# EAGLE design mikrobus-relay-1 (EAGLE 9.6.2)
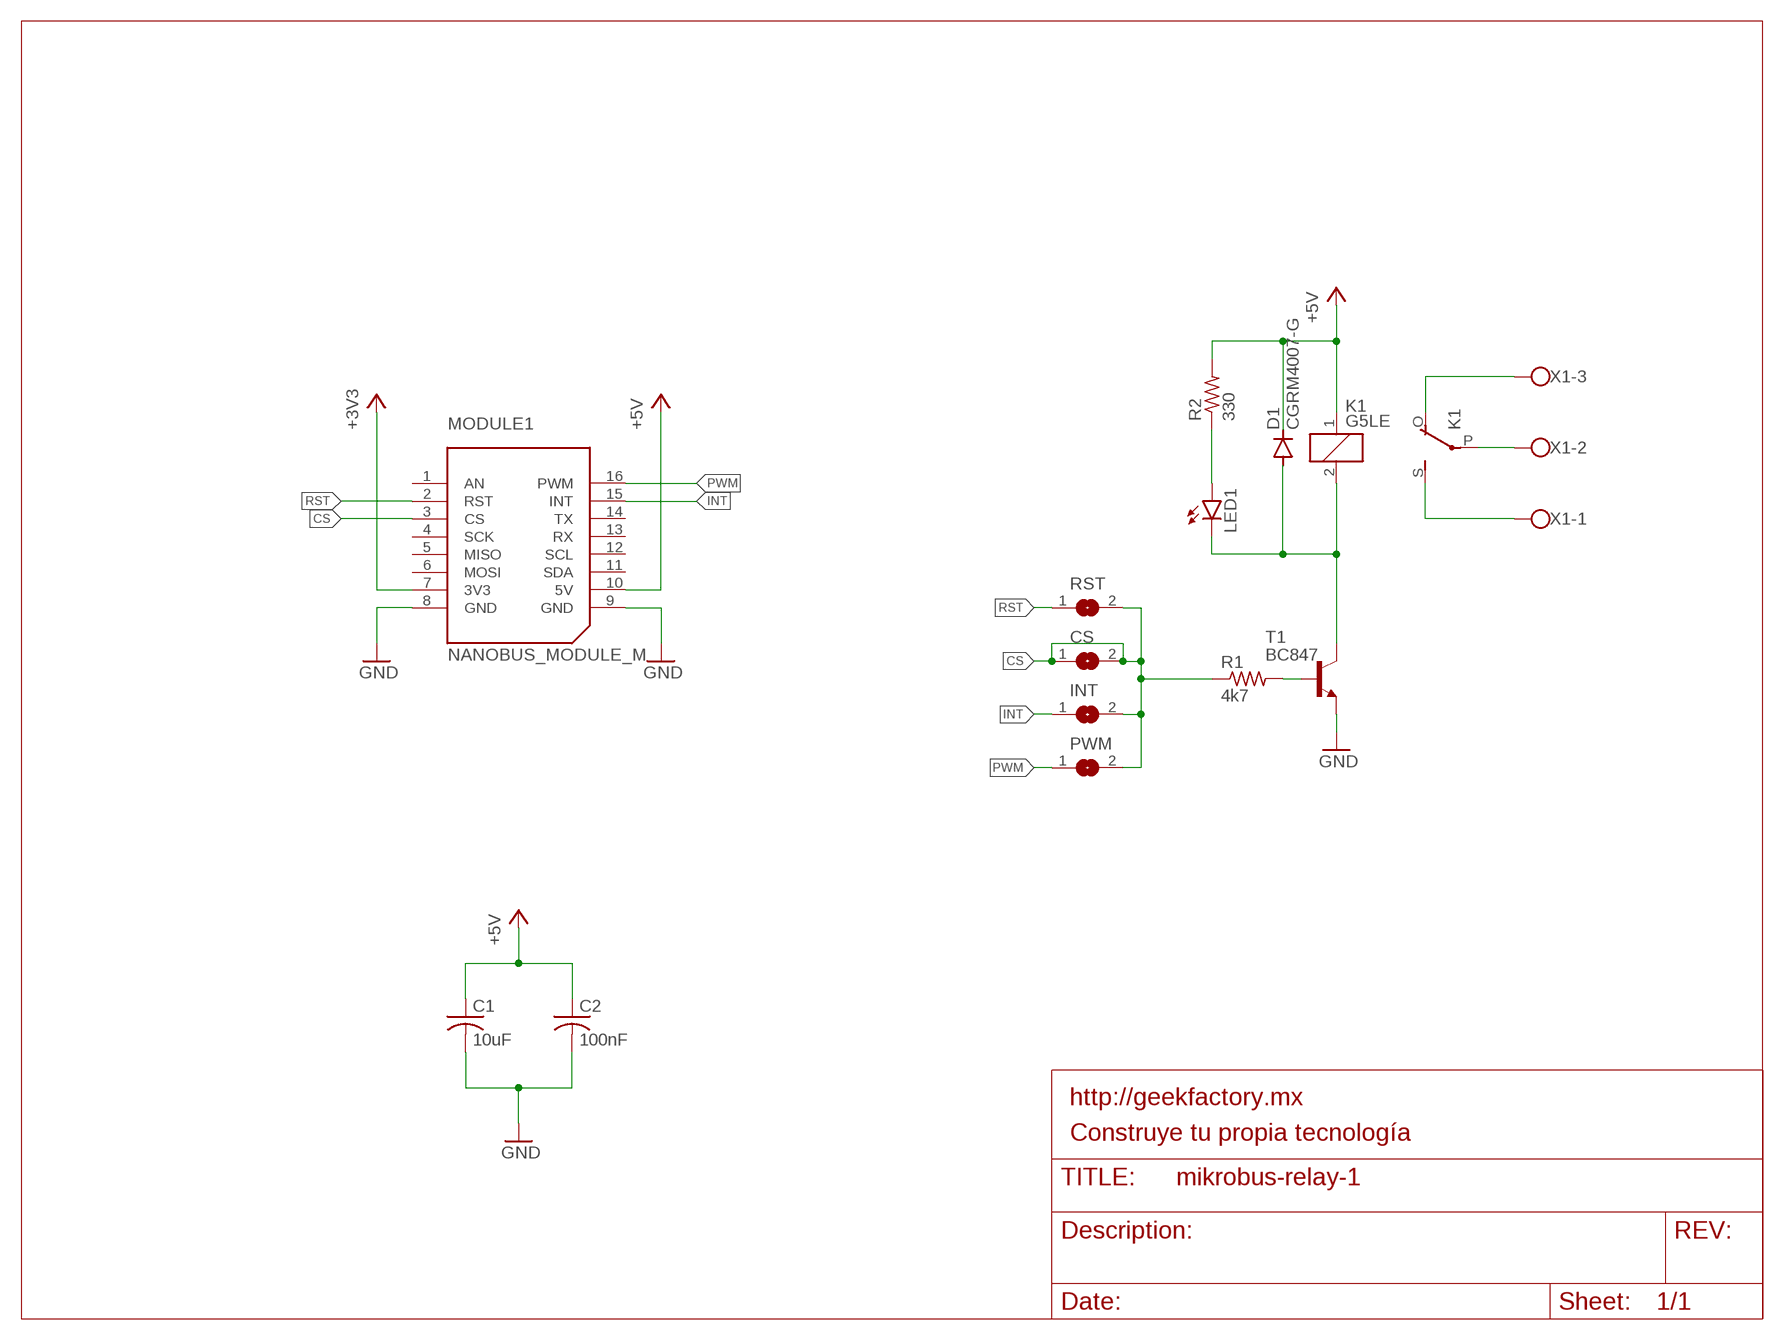
[diagram p0: schematic, sheet 1]

## Parts
C1  10uF  C-USC0805  [C0805]
C2  100nF  C-USC0805  [C0805]
CS  SJ  [SJ]
D1  CGRM4007-G  [SOD-123_MINI-SMA]
INT  SJ  [SJ]
K1  G5LE  [G5LE]
LED1  LEDCHIPLED_0805  [CHIPLED_0805]
MODULE1  NANOBUS_MODULE_M  [NANOBUS_MODULE_MIDDLE]
PWM  SJ  [SJ]
R1  4k7  R-US_R0805  [R0805]
R2  330  R-US_R0805  [R0805]
RST  SJ  [SJ]
T1  BC847  [SOT23]
X1  SCREW-TERMINAL-3-5-0  [SCREW-TERMINAL-5.0MM-3]

## Nets
+3V3: MODULE1.7(3V3)
+5V: C1.1 C2.1 D1.C K1.1 MODULE1.10(5V) R2.2
CS: CS.1 CS.2 INT.2 MODULE1.3(CS) PWM.2 R1.1 RST.2
GND: C1.2 C2.2 MODULE1.8(GND) MODULE1.9(GND) T1.2(E)
INT: INT.1 MODULE1.15(INT)
N$4: D1.A K1.2 LED1.C T1.3(C)
N$5: LED1.A R2.1
N$6: R1.2 T1.1(B)
PWM: MODULE1.16(PWM) PWM.1
RCOM: K1.P(2:P) X1.2
RNC: K1.O(2:O) X1.3
RNO: K1.S(2:S) X1.1
RST: MODULE1.2(RST) RST.1
Unconnected: MODULE1.1(AN) MODULE1.4(SCK) MODULE1.5(MISO) MODULE1.6(MOSI) MODULE1.11(SDA) MODULE1.12(SCL) MODULE1.13(RX) MODULE1.14(TX)

## Library data of the parts
C1 C2 = rcl:C-US: CAPACITOR, American symbol; SPICEPREFIX: C
CS INT PWM RST = jumper:SJ: SMD solder JUMPER
D1 = diode:CGRM400*-G: Molded plasitc,JEDEC SOD-123/Mini SMA Source: Comchip CGRM4001-G.pdf
K1 = relay:G5LE: RELAY 1 x switch, 10 A/120 V AC, 8 A/30 V DC, Omron; OC_FARNELL: unknown; OC_NEWARK: unknown
LED1 = led:LED: LED OSRAM: - CHIPLED LG R971, LG N971, LY N971, LG Q971, LY Q971, LO R971, LY R971 LH N974, LH R974 LS Q976, LO Q976, LY Q976 LO Q996 - Hyper CHIPLED LW Q18S LB Q993, LB Q99A, LB R99A - SideLED LS A670, LO A670, LY A670, LG A670, LP A670 LB A673, LV A673, LT A673, LW A673 LH A674 LY A675 LS A676, LA A676, LO A676, LY A676, LW A676 LS A679, LY A679, LG A679 - Hyper Micro SIDELED® LS Y876, LA Y876, LO Y876, LY Y876 LT Y87S - SmartLED LW L88C, LW L88S LB L89C, LB L89S, LG L890 LS L89K, LO L89K, LY L89K LS L896, LA L896, LO L896, LY L896 - TOPLED LS T670, LO T670, LY T670, LG T670, LP T670 LSG T670, LSP T670, LSY T670, LOP T670, LYG T670 LG T671, LOG T671, LSG T671 LB T673, LV T673, LT T673, LW T673 LH T674 LS T676, LA T676, LO T676, LY T676, LB T676, LH T676, LSB T676, LW T676 LB T67C, LV T67C, LT T67C, LS T67K, LO T67K, LY T67K, LW E67C LS E67B, LA E67B, LO E67B, LY E67B, LB E67C, LV E67C, LT E67C LW T67C LS T679, LY T679, LG T679 LS T770, LO T770, LY T770, LG T770, LP T770 LB T773, LV T773, LT T773, LW T773 LH T774 LS E675, LA E675, LY E675, LS T675 LS T776, LA T776, LO T776, LY T776, LB T776 LHGB T686 LT T68C, LB T68C - Hyper Mini TOPLED® LB M676 - Mini TOPLED Santana® LG M470 LS M47K, LO M47K, LY M47K Source: http://www.osram.convergy.de LUXEON: - LUMILED® LXK2-PW12-R00, LXK2-PW12-S00, LXK2-PW14-U00, LXK2-PW14-V00 LXK2-PM12-R00, LXK2-PM12-S00, LXK2-PM14-U00 LXK2-PE12-Q00, LXK2-PE12-R00, LXK2-PE12-S00, LXK2-PE14-T00, LXK2-PE14-U00 LXK2-PB12-K00, LXK2-PB12-L00, LXK2-PB12-M00, LXK2-PB14-N00, LXK2-PB14-P00, LXK2-PB14-Q00 LXK2-PR12-L00, LXK2-PR12-M00, LXK2-PR14-Q00, LXK2-PR14-R00 LXK2-PD12-Q00, LXK2-PD12-R00, LXK2-PD12-S00 LXK2-PH12-R00, LXK2-PH12-S00 LXK2-PL12-P00, LXK2-PL12-Q00, LXK2-PL12-R00 Source: www.luxeon.com KINGBRIGHT: KA-3528ASYC Source: www.kingbright.com
MODULE1 = nanobus:NANOBUS_MODULE
R1 R2 = rcl:R-US_: RESISTOR, American symbol; SPICEPREFIX: R
T1 = transistor:BC847: NPN TRANSISTOR
X1 = GF-Connectors:SCREW-TERMINAL-3

## Board
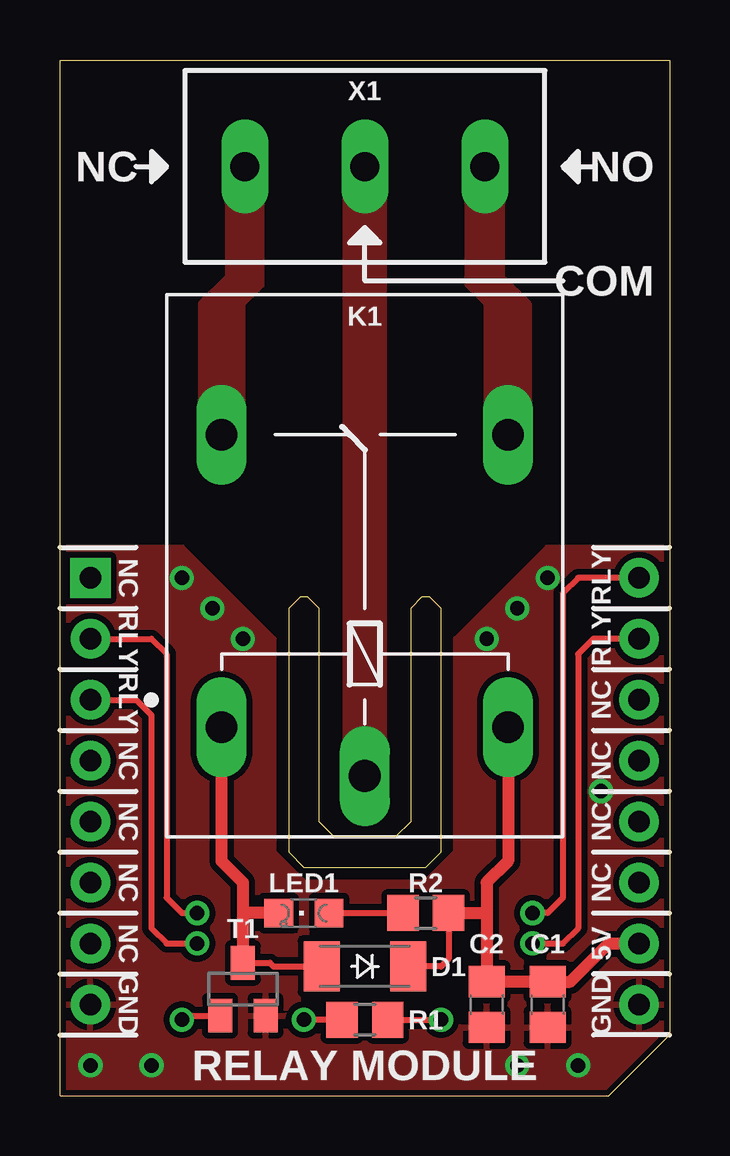
[diagram p1: board, top side]
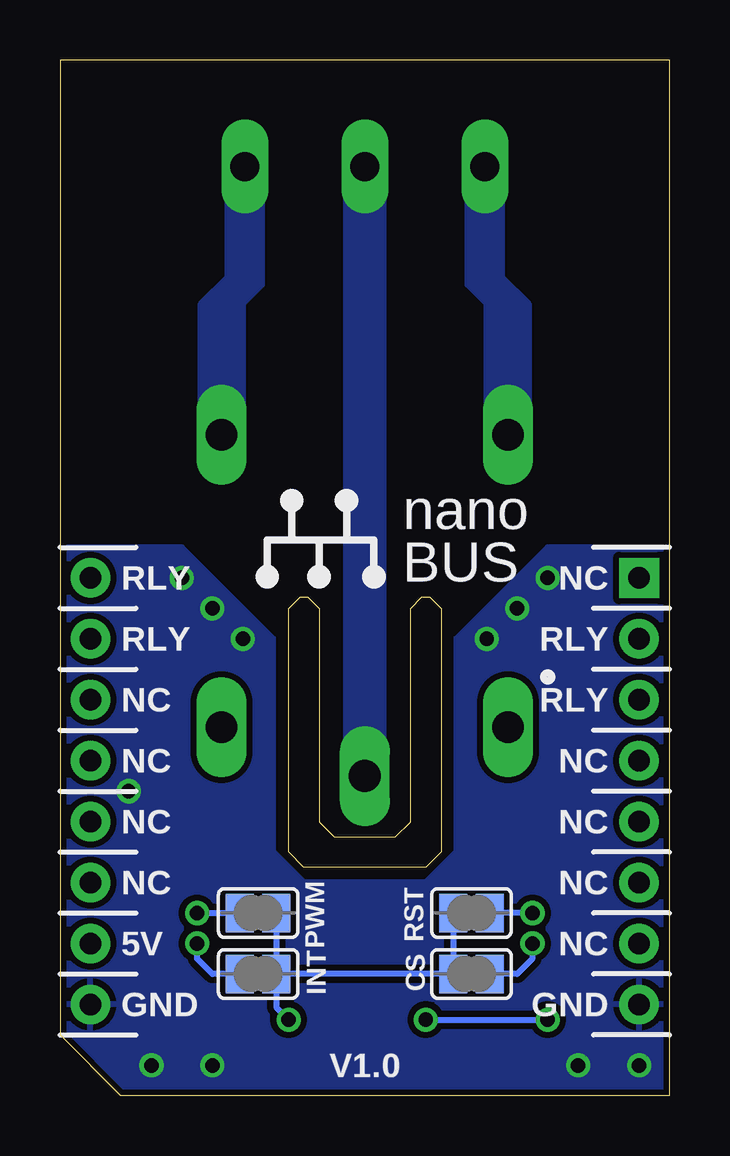
[diagram p2: board, bottom side, seen from below]

Size 25.4 x 43.18 mm. Coordinates in mm from the lower left corner, seen from the top.
Copper layers (1*16): Top 0.035mm / dielectric 1.5mm / Bottom 0.035mm
Design rules "10mil_generic *": minimum track width 10mil, minimum drill 0.6mm, track to track 10mil, track to pad 10mil, pad to pad 10mil, via to via 10mil, smd to smd 10mil, copper to edge 10mil, drill to drill 8mil, minimum pad ring 15mil, minimum via ring 8mil, stop-mask expansion 4mil, vias tented up to drill 0.6mm, thermal gap 10mil
Milling: 16 lines

### Footprints (pad centres in the part's own frame; a part is rotated, then mirrored left to right if it is on the bottom)
C0805 = smd 1.3 x 1.5: 1 -0.95,0; 2 0.95,0
SJ = smd 1.168 x 1.6: 1 -0.762,0; 2 0.762,0
SOD-123_MINI-SMA = smd 1.5 x 2.1: A 1.8,0; C -1.8,0
G5LE = drill 1.321 long: 1 -7.493,-5.969; 2 -7.493,5.969; O 4.699,5.969; P -9.525,0; S 4.699,-5.969
CHIPLED_0805 = smd 1.2 x 1.2: A 0,-1.05; C 0,1.05
NANOBUS_MODULE_MIDDLE = drill 0.889 pad 1.676 square: 1 1.27,21.59 | drill 0.889 pad 1.524: 2 1.27,19.05; 3 1.27,16.51; 4 1.27,13.97; 5 1.27,11.43; 6 1.27,8.89; 7 1.27,6.35; 8 1.27,3.81; 9 24.13,3.81; 10 24.13,6.35; 11 24.13,8.89; 12 24.13,11.43; 13 24.13,13.97; 14 24.13,16.51; 15 24.13,19.05; 16 24.13,21.59
R0805 = smd 1.3 x 1.5: 1 -0.95,0; 2 0.95,0
SOT23 = smd 1 x 1.4: 1 -0.95,-1.1; 2 0.95,-1.1; 3 0,1.1
SCREW-TERMINAL-5.0MM-3 = drill 1.2 long: 1 -5,0; 2 0,0; 3 5,0

### Placement (x,y rotation side)
C1  20.32,3.81 270 top
C2  17.78,3.81 270 top
CS  8.26,5.08 180 bottom
D1  12.7,5.4 180 top
INT  17.14,5.08 0 bottom
K1  12.7,22.86 90 top
LED1  10.16,7.62 90 top
MODULE1  0,0 0 top
PWM  17.14,7.62 0 bottom
R1  12.7,3.17 180 top
R2  15.24,7.62 0 top
RST  8.26,7.62 180 bottom
T1  7.62,4.45 0 top
X1  12.7,38.73 180 top

### Tracks (layer width: path | path; a pad name or v marks a point on that pad's centre or on a via)
+5V
  Top 0.254: R2.2 16.19,5.71 15.88,5.4 D1.C
  Top 0.508: K1.1 18.67,9.78 17.78,8.89 17.78,7.62 | 17.78,7.62 C2.1 C1.1 21.27,4.76 22.86,6.35 MODULE1.10 | R2.2 17.78,7.62
CS  (via drill 0.6)
  Top 0.254: MODULE1.3 3.17,16.51 3.81,15.88 3.81,6.99 4.45,6.35 v5.71,6.35 | R1.1 v15.88,3.17
  Bottom 0.254: CS.2 CS.1 6.35,5.08 5.71,5.71 v5.71,6.35 | RST.2 CS.2 | PWM.2 INT.2 | CS.2 INT.2 | INT.2 16.38,3.68 v15.88,3.17
GND  (via drill 0.6)
  other vias: 7.62,19.05 17.78,19.05 6.35,20.32 5.08,21.59 19.05,20.32 20.32,21.59 3.81,1.27 1.27,1.27 21.59,1.27 19.05,1.27 22.54,12.7
  pour Top: 0,22.86 5.08,22.86 8.89,19.05 8.89,10.16 10.16,8.89 15.24,8.89 16.51,10.16 16.51,19.05 20.32,22.86 25.4,22.86 25.4,2.54 22.86,0 0,0
  pour Bottom: 0,0 0,22.86 5.08,22.86 8.89,19.05 8.89,10.16 10.16,8.89 15.24,8.89 16.51,10.16 16.51,19.05 20.32,22.86 25.4,22.86 25.4,2.54 22.86,0
INT  (via drill 0.6)
  Top 0.254: MODULE1.15 22.23,19.05 21.59,18.41 21.59,6.99 20.95,6.35 v19.68,6.35
  Bottom 0.254: INT.1 19.05,5.08 19.68,5.71 v19.68,6.35
N$4
  Top 0.254: T1.3 8.74,5.54 8.89,5.4 D1.A
  Top 0.508: 7.62,7.62 7.62,8.89 6.73,9.78 K1.2 | 7.62,7.62 T1.3 | LED1.C 7.62,7.62
N$5
  Top 0.254: LED1.A R2.1
N$6  (via drill 0.6)
  Top 0.254: R1.2 v10.16,3.17 | v5.08,3.17 5.25,3.35 T1.1
  Bottom 0.254: v10.16,3.17 v5.08,3.17
PWM  (via drill 0.6)
  Top 0.254: MODULE1.16 21.59,21.59 20.95,20.95 20.95,8.26 20.32,7.62 v19.68,7.62
  Bottom 0.254: v19.68,7.62 PWM.1
RCOM
  pour Top (no thermals): 11.91,39.37 13.49,39.37 13.49,12.7 11.91,12.7
  pour Bottom (no thermals): 11.91,39.37 13.49,39.37 13.49,12.7 11.91,12.7
RNC
  pour Top (no thermals): 8.41,39.37 6.99,39.37 6.99,34.13 5.87,33.02 5.87,26.67 7.62,26.67 7.62,33.02 8.41,33.81
  pour Bottom (no thermals): 5.87,26.67 7.62,26.67 7.62,33.02 8.41,33.81 8.41,39.37 6.99,39.37 6.99,34.13 5.87,33.02
RNO
  pour Top (no thermals): 16.99,39.37 18.41,39.37 18.41,34.13 19.53,33.02 19.53,26.67 17.78,26.67 17.78,33.02 16.99,33.81
  pour Bottom (no thermals): 17.78,26.67 19.53,26.67 19.53,33.02 18.41,34.13 18.41,39.37 16.99,39.37 16.99,33.81 17.78,33.02
RST  (via drill 0.6)
  Top 0.254: MODULE1.2 3.81,19.05 4.45,18.41 4.45,8.26 5.08,7.62 v5.71,7.62
  Bottom 0.254: v5.71,7.62 RST.1

### Text on the board
tNames: NC | NO | COM | NC | RLY | RLY | RLY | RLY | NC | NC | NC | NC | NC | NC | NC | NC | 5V | GND | GND | RELAY MODULE
bNames: NC | RLY | RLY | RLY | RLY | NC | NC | NC | NC | NC | NC | NC | NC | 5V | GND | GND | V1.0